# Altium schematic sheet ad.SchDoc
size A4
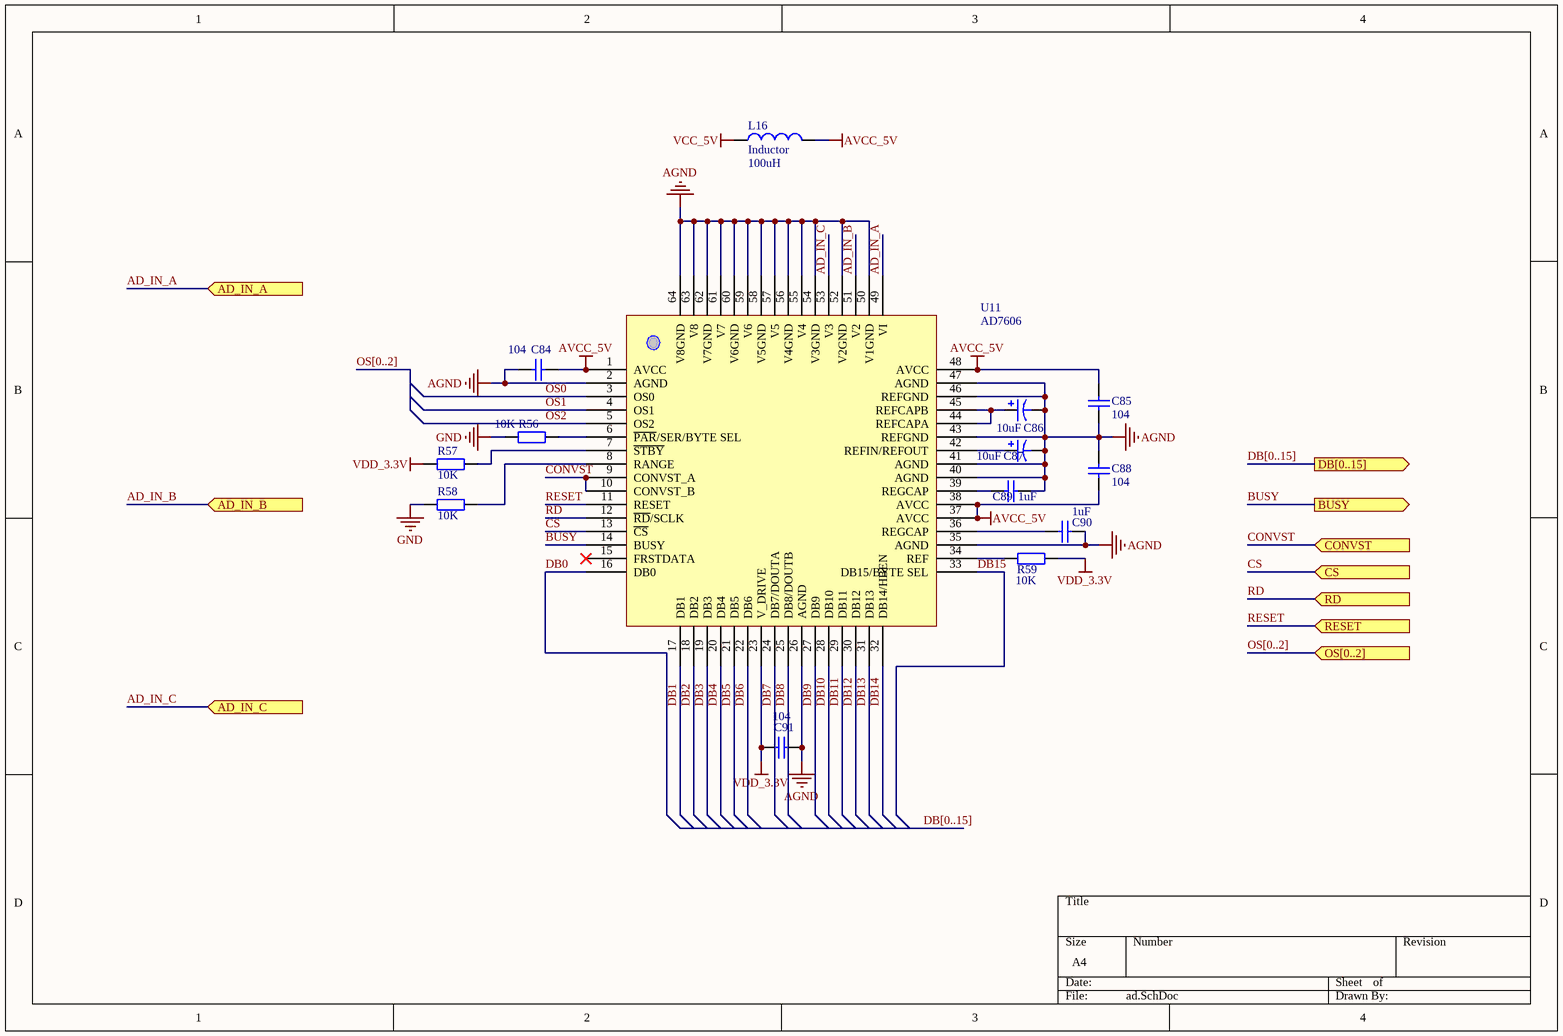
[diagram p0: ad.SchDoc]

## Parts
C84  value 104  [0805]  (hidden comment: Cap)
C85  value 104  [0805]  (hidden comment: Cap)
C86  value 10uF  [Cap 3528B]  (hidden comment: Cap Poll)
C87  value 10uF  [Cap 3528B]  (hidden comment: Cap Poll)
C88  value 104  [0805]  (hidden comment: Cap)
C89  value 1uF  [0805]  (hidden comment: Cap)
C90  value 1uF  [0805]  (hidden comment: Cap)
C91  value 104  [0805]  (hidden comment: Cap)
L16  Inductor  value 100uH  [0805_Inductor]
R56  value 10K  [0805]  (hidden comment: Res)
R57  value 10K  [0805]  (hidden comment: Res)
R58  value 10K  [0805]  (hidden comment: Res)
R59  value 10K  [0805]  (hidden comment: Res)
U11  AD7606  [TSQFP50P1200X1200X160-64N]

## Ports
AD_IN_A (in), AD_IN_B (in), AD_IN_C (in), BUSY (out), CONVST (in), CS (in), DB[0..15] (out), OS[0..2] (in), RD (in), RESET (in)

## Nets
AGND: C84.2 C85.2 C86.2 C87.2 C88.1 C89.1 C90.1 C91.1 U11.2(AGND) U11.26(AGND) U11.35(AGND) U11.40(AGND) U11.41(AGND) U11.43(REFGND) U11.46(REFGND) U11.47(AGND) U11.50(V1GND) U11.52(V2GND) U11.54(V3GND) U11.55(V4) U11.56(V4GND) U11.57(V5) U11.58(V5GND) U11.59(V6) U11.60(V6GND) U11.61(V7) U11.62(V7GND) U11.63(V8) U11.64(V8GND)
AVCC_5V: C84.1 C85.1 C88.2 L16.2 U11.1(AVCC) U11.37(AVCC) U11.38(AVCC) U11.48(AVCC)
GND: R56.1 R58.1
VCC_5V: L16.1
VDD_3.3V: C91.2 R57.1 R59.2 U11.23(V_DRIVE)
AD_IN_A: U11.49(VI) ; port AD_IN_A
AD_IN_B: U11.51(V2) ; port AD_IN_B
AD_IN_C: U11.53(V3) ; port AD_IN_C
BUSY: U11.14(BUSY) ; port BUSY
CONVST: U11.9(CONVST_A) U11.10(CONVST_B) ; port CONVST
CS: U11.13(~{CS}) ; port CS
DB0: U11.16(DB0)
DB1: U11.17(DB1)
DB2: U11.18(DB2)
DB3: U11.19(DB3)
DB4: U11.20(DB4)
DB5: U11.21(DB5)
DB6: U11.22(DB6)
DB7: U11.24(DB7/DOUTA)
DB8: U11.25(DB8/DOUTB)
DB9: U11.27(DB9)
DB10: U11.28(DB10)
DB11: U11.29(DB11)
DB12: U11.30(DB12)
DB13: U11.31(DB13)
DB14: U11.32(DB14/HBEN)
DB15: U11.33(DB15/BYTE_SEL)
OS0: U11.3(OS0)
OS1: U11.4(OS1)
OS2: U11.5(OS2)
RD: U11.12(~{RD}/SCLK) ; port RD
RESET: U11.11(RESET) ; port RESET
NetC86_1: C86.1 U11.44(REFCAPA) U11.45(REFCAPB)
NetC87_1: C87.1 U11.42(REFIN/REFOUT)
NetC89_2: C89.2 U11.39(REGCAP)
NetC90_2: C90.2 U11.36(REGCAP)
NetR56_2: R56.2 U11.6(~{PAR}/SER/BYTE_SEL)
NetR57_2: R57.2 U11.7(~{STBY})
NetR58_2: R58.2 U11.8(RANGE)
NetR59_1: R59.1 U11.34(REF)

Not connected (* = marked no-connect by the designer): U11 15(FRSTDATA)*

## Buses and harness runs
bus DB[0..15]
bus DB[0..15] = port DB[0..15]
bus OS[0..2]
bus OS[0..2] = port OS[0..2]

## Library data of the parts
C84 C85 C88-C91 = Cap: 原理图绘制者: 刘永钦; 原理图何处使用过: 2014年飞思卡尔底板; 原理图审核人1: 徐鹏飞; 封装0805何处使用: 2015年航行器遥控器; 原理图审核人2: 朱觉文; 封装0603何处使用过: 在2401转接板上使用; Pressure Voltage: 16V; 原理图提供者: 刘永钦; 封装0805绘制者: 刘永钦; 封装0805提供者: 刘永钦; 封装0805审核人1: 徐鹏飞; 封装0805审核人2: 朱觉文; 封装0603绘制者: 刘永钦; 封装0603提供者: 刘永钦; 封装0603审核人1: 朱觉文; 封装0603审核人2: 徐鹏飞
C86 C87 = Cap Poll: 原理图绘制者: 刘永钦; 原理图何处使用过: 2014年飞思卡尔底板; 原理图审核人1: 徐鹏飞; 封装CAP 钽 7343 E何处使用: 2014年飞思卡尔驱动板; 封装cap贴片铝电解质470uF 16V绘制者: 李泽; 封装cap贴片铝电解质470uF 16V何处使用: 2015年飞思卡尔主板; 封装Cap 3528B绘制者: 陈汉诚; 封装Cap 3528B使用过: 2015年飞思卡尔驱动板; 封装Cap直插 10uF 50V: 10级718学长; 封装Cap直插 10uF 50V使用过: 2012年XS128学习板的主板; 封装Cap 3528B审核人2: 朱觉文; Pressure Voltage: 16V; 原理图提供者: 刘永钦; 封装CAP 钽 7343 E绘制者: 刘永钦; 封装CAP 钽 7343 E提供者: 刘永钦; 封装CAP 钽 7343 E审核人1: 徐鹏飞; 封装cap贴片铝电解质470uF 16V提供者: 刘永钦; 封装cap贴片铝电解质470uF 16V审核人1: 徐鹏飞; 封装Cap 3528B提供者: 刘永钦; 封装Cap 3528B审核人1: 徐鹏飞; 封装Cap直插 10uF 50V提供者: 刘永钦; 封装Cap直插 10uF 50V审核人1: 徐鹏飞; 封装Cap直插 10uF 50V审核人2: 朱觉文; 封装cap贴片铝电解质470uF 16V审核人2: 朱觉文; 封装CAP 钽 7343 E审核人2: 朱觉文; 原理图审核人2: 朱觉文
L16 = Inductor: 原理图绘制者: 刘永钦; 原理图何处使用过: 2014年飞思卡尔底板; 原理图审核人1: 徐鹏飞; 封装0805_Inductor绘制者: 未知; 封装0805_Inductor使用过: 2015年飞思卡尔底板; 原理图审核人2: 朱觉文; 原理图提供者: 刘永钦; 封装0805_Inductor提供者: 刘永钦; 封装0805_Inductor审核人1: 徐鹏飞; 封装0805_Inductor审核人2: 朱觉文
R56-R59 = Res: 原理图绘制者: 刘永钦; 原理图何处使用过: 2014年飞思卡尔底板; 原理图审核人1: 徐鹏飞; 封装0805何处使用过: 2015年航行器遥控器; 原理图审核人2: 朱觉文; 封装2512-RESC6332X06N何处使用过: 在无刷直流电机驱动板上使用过; 封装0603何处使用过: 在2401转接板上使用; 原理图提供者: 刘永钦; 封装0805绘制者: 刘永钦; 封装0805提供者: 刘永钦; 封装0805审核人1: 徐鹏飞; 封装0805审核人2: 朱觉文; 封装0603提供者: 刘永钦; 封装0603审核人2: 朱觉文; 封装0603审核人1: 徐鹏飞; 封装2512-RESC6332X06N审核人2: 朱觉文; 封装2512-RESC6332X06N提供者: 刘永钦; 封装2512-RESC6332X06N审核人1: 徐鹏飞; 封装0603绘制者: 刘永钦; 封装2512-RESC6332X06N绘制者: 刘永钦